# Altium project Driver LCD.PrjPcb
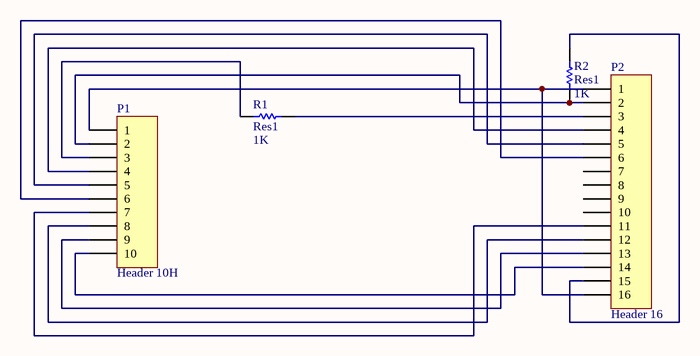
[diagram p0: Driver LCD.SchDoc]
1 sheet, 4 parts. Net scope: global (net labels, ports and power ports of the same name join across sheets).
Board file: Driver LCD.PcbDoc

## Sheet Driver LCD.SchDoc
size A4

### Parts
P1  Header 10H  [HDR1X10H]
P2  Header 16  [HDR1X16]
R1  Res1  value 1K  [AXIAL-0.3]
R2  Res1  value 1K  [AXIAL-0.3]

### Nets
NetP1_1: P1.1 P2.1 P2.16
NetP1_2: P1.2 P2.2 R2.1
NetP1_3: P1.3 R1.1
NetP1_4: P1.4 P2.4
NetP1_5: P1.5 P2.5
NetP1_6: P1.6 P2.6
NetP1_7: P1.7 P2.11
NetP1_8: P1.8 P2.12
NetP1_9: P1.9 P2.13
NetP1_10: P1.10 P2.14
NetP2_3: P2.3 R1.2
NetP2_15: P2.15 R2.2

Not connected (* = marked no-connect by the designer): P2 7 8 9 10

### Library data of the parts
P1 = Header 10H: Header, 10-Pin, Right Angle; LatestRevisionDate: 17-Jul-2002; LatestRevisionNote: Re-released for DXP Platform.; Publisher: Altium Limited
P2 = Header 16: Header, 16-Pin; LatestRevisionDate: 17-Jul-2002; LatestRevisionNote: Re-released for DXP Platform.; Publisher: Altium Limited
R1 R2 = Res1: Resistor; Published: 8-Jun-2000; LatestRevisionDate: 17-Jul-2002; LatestRevisionNote: Re-released for DXP Platform.; PackageReference: AXIAL-0.3; Publisher: Altium Limited